# EAGLE design connector_schematic (EAGLE 9.3.2)
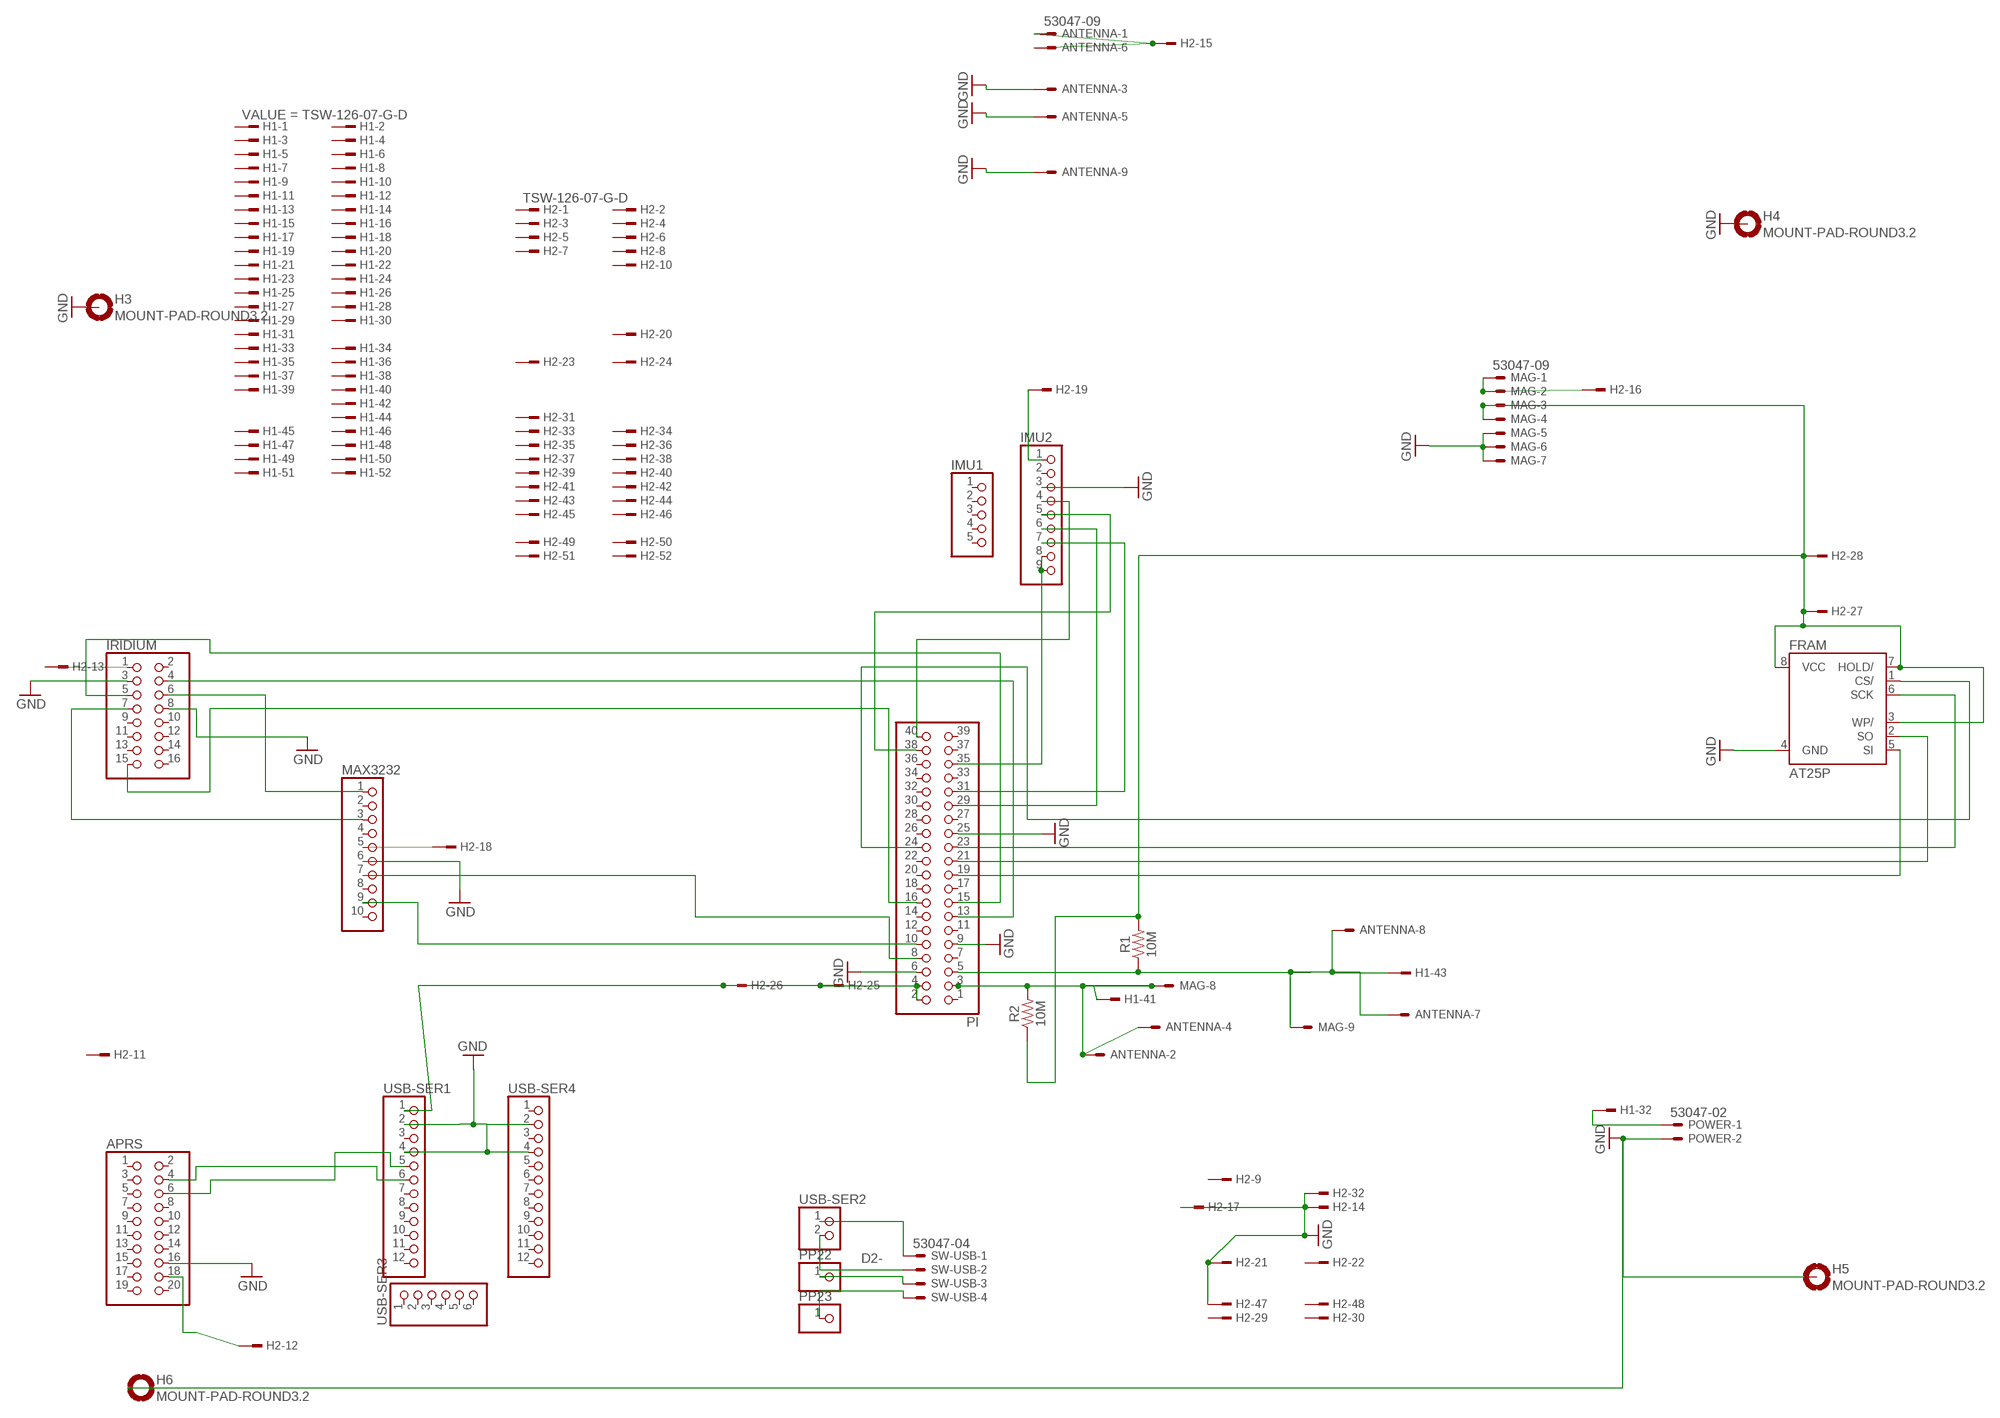
[diagram p0: schematic, sheet 1]

## Parts
ANTENNA  53047-09  [53047-09]
APRS  PINHD-2X10  [2X10]
FRAM  AT25P  [DIL08]
H1  TSW-126-07-G-D  [TSW-126-XX-G-D]
H2  TSW-126-07-G-D  [TSW-126-XX-G-D]
H3  MOUNT-PAD-ROUND3.2  [3,2-PAD]
H4  MOUNT-PAD-ROUND3.2  [3,2-PAD]
H5  MOUNT-PAD-ROUND3.2  [3,2-PAD]
H6  MOUNT-PAD-ROUND3.2  [3,2-PAD]
IMU1  PINHD-1X5  [1X05]
IMU2  PINHD-1X9  [1X09]
IRIDIUM  PINHD-2X8  [2X08]
MAG  53047-09  [53047-09]
MAX3232  PINHD-1X10  [1X10]
PI  PINHD-2X20  [2X20]
POWER  53047-02  [53047-02]
PP22  PINHD-1X1  [1X01]
PP23  PINHD-1X1  [1X01]
R1  10M  10MOHM-HORIZ-1/4W-5%  [AXIAL-0.3]
R2  10M  10MOHM-HORIZ-1/4W-5%  [AXIAL-0.3]
SW-USB  53047-04  [53047-04]
USB-SER1  PINHD-1X12  [1X12]
USB-SER2  PINHD-1X2  [1X02]
USB-SER3  PINHD-1X6  [1X06]
USB-SER4  PINHD-1X12  [1X12]

## Nets
3V3: FRAM.3(WP/) FRAM.7(HOLD/) FRAM.8(VCC) H2.27 H2.28 MAG.3 MAG.4 R1.P$2 R2.P$1
5V: H2.25 H2.26 PI.2 PI.4 USB-SER1.1
D2+: SW-USB.1 USB-SER2.1
D2-: SW-USB.2 USB-SER2.2
D+: PP22.1 SW-USB.3
D-: PP23.1 SW-USB.4
GND: ANTENNA.3 ANTENNA.5 ANTENNA.9 APRS.16 FRAM.4(GND) H2.14 H2.17 H2.21 H2.32 H2.47 H3.B3,2(MOUNT) H4.B3,2(MOUNT) H5.B3,2(MOUNT) H6.B3,2(MOUNT) IMU2.3 IRIDIUM.3 IRIDIUM.8 MAG.5 MAG.6 MAG.7 MAX3232.6 PI.6 PI.9 PI.25 POWER.2 USB-SER1.2 USB-SER1.4 USB-SER4.2 USB-SER4.4
N$1: APRS.18 H2.12
N$3: IMU2.5 PI.38
N$4: APRS.6 USB-SER1.5
N$5: H2.19 IMU2.1
N$6: ANTENNA.1 ANTENNA.6 H2.15
N$7: H2.13 IRIDIUM.1
N$8: IRIDIUM.4 PI.13
N$9: IRIDIUM.5 PI.15
N$10: IRIDIUM.15 PI.16
N$12: MAX3232.7 PI.8
N$13: H1.32 POWER.1
N$14: APRS.4 USB-SER1.6
N$17: FRAM.5(SI) PI.19
N$18: FRAM.6(SCK) PI.23
N$19: FRAM.1(CS/) PI.24
N$20: FRAM.2(SO) PI.21
N$21: MAX3232.9 PI.10
N$24: IRIDIUM.6 MAX3232.1
N$25: IRIDIUM.7 MAX3232.3
N$32: IMU2.4 PI.40
N$33: IMU2.6 PI.29
N$34: IMU2.7 PI.31
N$35: IMU2.8 IMU2.9 PI.35
N$36: H2.16 MAG.1 MAG.2
N$37: H2.18 MAX3232.5
SCL: ANTENNA.7 ANTENNA.8 H1.43 MAG.9 PI.5 R1.P$1
SDA: ANTENNA.2 ANTENNA.4 H1.41 MAG.8 PI.3 R2.P$2
Unconnected: APRS.1 APRS.2 APRS.3 APRS.5 APRS.7 APRS.8 APRS.9 APRS.10 APRS.11 APRS.12 APRS.13 APRS.14 APRS.15 APRS.17 APRS.19 APRS.20 H1.1 H1.2 H1.3 H1.4 H1.5 H1.6 H1.7 H1.8 H1.9 H1.10 H1.11 H1.12 H1.13 H1.14 H1.15 H1.16 H1.17 H1.18 H1.19 H1.20 H1.21 H1.22 H1.23 H1.24 H1.25 H1.26 H1.27 H1.28 H1.29 H1.30 H1.31 H1.33 H1.34 H1.35 H1.36 H1.37 H1.38 H1.39 H1.40 H1.42 H1.44 H1.45 H1.46 H1.47 H1.48 H1.49 H1.50 H1.51 H1.52 H2.1 H2.2 H2.3 H2.4 H2.5 H2.6 H2.7 H2.8 H2.9 H2.10 H2.11 H2.20 H2.22 H2.23 H2.24 H2.29 H2.30 H2.31 H2.33 H2.34 H2.35 H2.36 H2.37 H2.38 H2.39 H2.40 H2.41 H2.42 H2.43 H2.44 H2.45 H2.46 H2.48 H2.49 H2.50 H2.51 H2.52 IMU1.1 IMU1.2 IMU1.3 IMU1.4 IMU1.5 IMU2.2 IRIDIUM.2 IRIDIUM.9 IRIDIUM.10 IRIDIUM.11 IRIDIUM.12 IRIDIUM.13 IRIDIUM.14 IRIDIUM.16 MAX3232.2 MAX3232.4 MAX3232.8 MAX3232.10 PI.1 PI.7 PI.11 PI.12 PI.14 PI.17 PI.18 PI.20 PI.22 PI.26 PI.27 PI.28 PI.30 PI.32 PI.33 PI.34 PI.36 PI.37 PI.39 USB-SER1.3 USB-SER1.7 USB-SER1.8 USB-SER1.9 USB-SER1.10 USB-SER1.11 USB-SER1.12 USB-SER3.1 USB-SER3.2 USB-SER3.3 USB-SER3.4 USB-SER3.5 USB-SER3.6 USB-SER4.1 USB-SER4.3 USB-SER4.5 USB-SER4.6 USB-SER4.7 USB-SER4.8 USB-SER4.9 USB-SER4.10 USB-SER4.11 USB-SER4.12

## Library data of the parts
ANTENNA MAG = con-molex:53?-09: CONNECTOR wire to board 1.25 mm (.049 inch) pitch header; MF: MOLEX; MPN: 53047-0910; OC_FARNELL: 9732888; OC_NEWARK: 98K9827
APRS = pinhead:PINHD-2X10: PIN HEADER
FRAM = atmel:AT25*: SPI bus serial EEPROM; MPN: CAT25040LI-G; OC_FARNELL: 1718045; OC_NEWARK: 06R0588
H1 H2 = con-samtec:TSW-126-*-G: THROUGH-HOLE .025" SQ POST HEADER Source: Samtec TSW.pdf; MF: Samtec Inc.; MPN: TSW-126-07-G-D
H3-H6 = holes:MOUNT-PAD-ROUND: MOUNTING PAD, round
IMU1 = pinhead:PINHD-1X5: PIN HEADER
IMU2 = pinhead:PINHD-1X9: PIN HEADER
IRIDIUM = pinhead:PINHD-2X8: PIN HEADER
MAX3232 = pinhead:PINHD-1X10: PIN HEADER
PI = pinhead:PINHD-2X20: PIN HEADER
POWER = con-molex:53?-02: CONNECTOR wire to board 1.25 mm (.049 inch) pitch header; MF: MOLEX; MPN: 53047-0210; OC_FARNELL: 9733051; OC_NEWARK: 57H4701
PP22 PP23 = pinhead:PINHD-1X1: PIN HEADER
R1 R2 = SparkFun-Resistors:10MOHM: RES-09327; PROD_ID: RES-09327
SW-USB = con-molex:53?-04: CONNECTOR wire to board 1.25 mm (.049 inch) pitch header; MF: WALDOM/MOLEX; MPN: 53047-0410; OC_FARNELL: 9733060; OC_NEWARK: 38C9900
USB-SER1 USB-SER4 = pinhead:PINHD-1X12: PIN HEADER
USB-SER2 = pinhead:PINHD-1X2: PIN HEADER
USB-SER3 = pinhead:PINHD-1X6: PIN HEADER

## Net classes
0 default: width 0.61 mm, clearance 0.127 mm

## Board
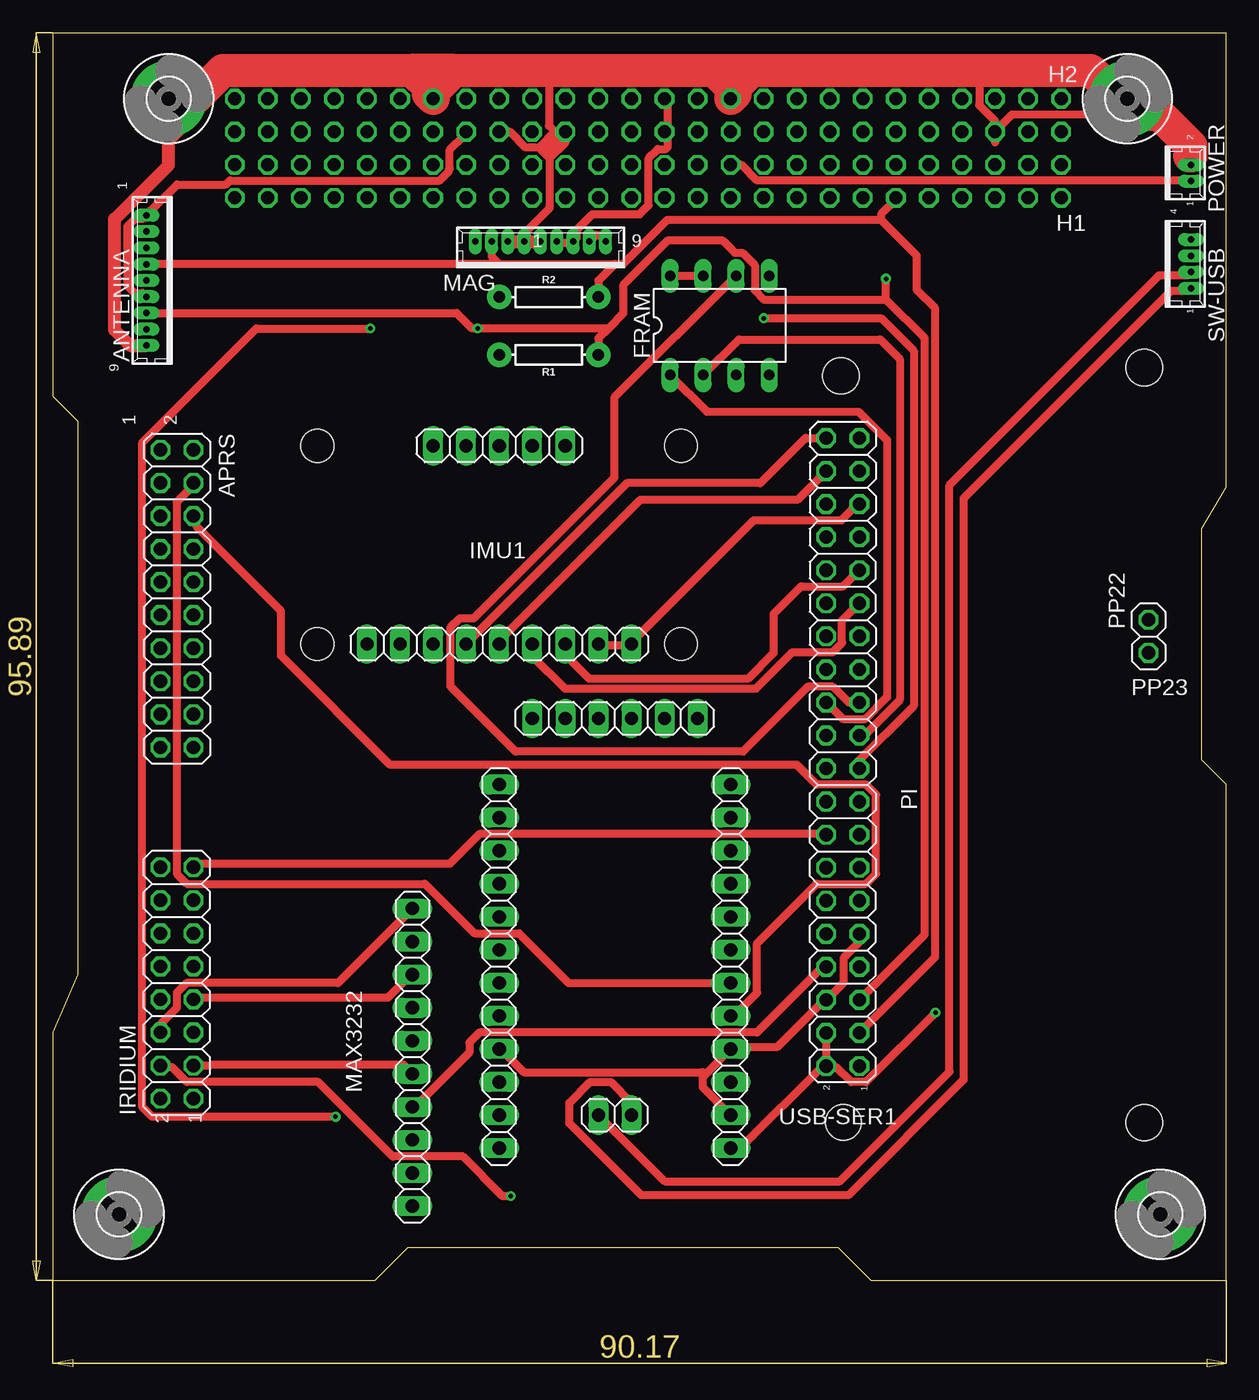
[diagram p1: board, top side]
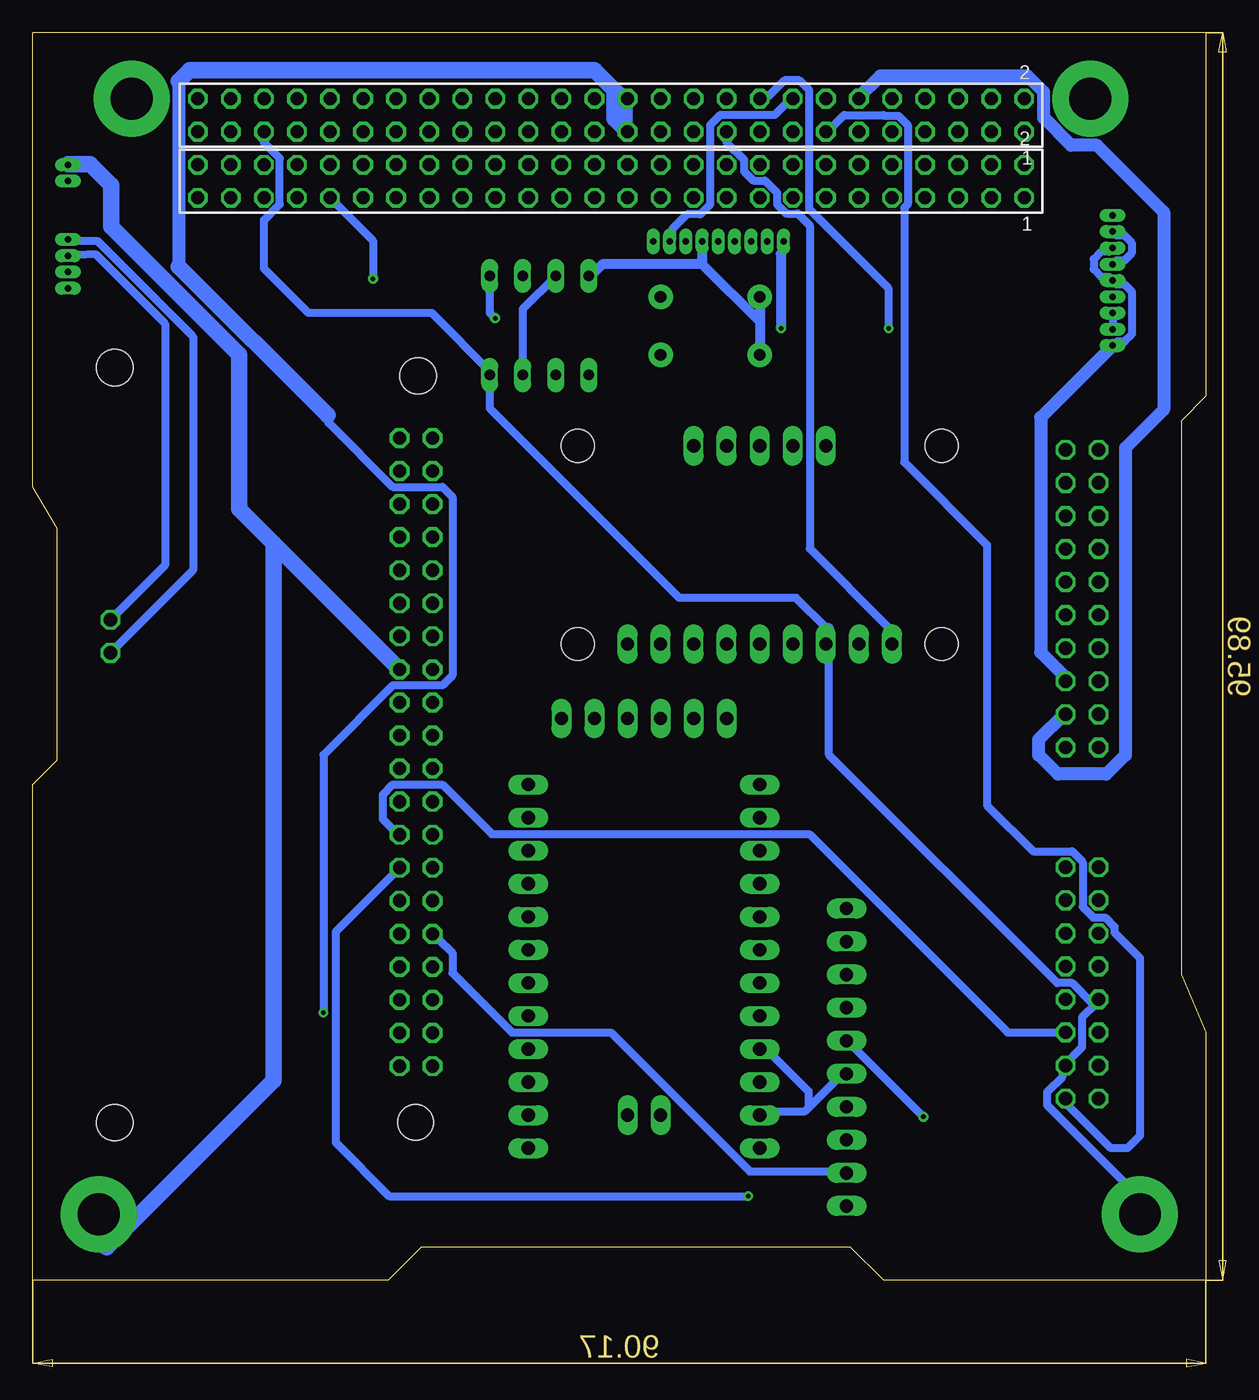
[diagram p2: board, bottom side, seen from below]

Size 90.17 x 95.89 mm. Coordinates in mm from the lower left corner, seen from the top.
Outline: 1.91,23.5 0,19.05 0,0 24.77,0 27.3,2.54 60.33,2.54 62.87,0 90.17,0 90.17,38.1 88.27,40.01 88.27,57.78 90.17,60.96 90.17,95.89 0,95.89 0,67.94 1.91,66.04 1.91,23.5
Copper layers (1*16): Top 0.035mm / dielectric 1.5mm / Bottom 0.035mm
Design rules "default": minimum track width 6mil, minimum drill 0.35mm, track to track 6mil, track to pad 6mil, pad to pad 6mil, via to via 6mil, smd to smd 6mil, copper to edge 40mil, drill to drill 6mil, minimum pad ring 10mil, minimum via ring 8mil, stop-mask expansion 4mil, vias tented up to drill 0mil, thermal gap 10mil
Holes 2.75 mm at 60.74,12.13
Holes 2.8 mm at 83.86,70.14 83.86,12.13 60.55,69.5
Holes 2.54 mm at 48.26,64.14 20.32,64.14 20.32,48.9 48.26,48.9

### Footprints (pad centres in the part's own frame; a part is rotated, then mirrored left to right if it is on the bottom)
53047-09 = drill 0.5 pad 0.698 long: 1 5,0.45; 2 3.75,0.45; 3 2.5,0.45; 4 1.25,0.45; 5 0,0.45; 6 -1.25,0.45; 7 -2.5,0.45; 8 -3.75,0.45; 9 -5,0.45
2X10 = drill 1.016 octagon: 1 -11.43,-1.27; 2 -11.43,1.27; 3 -8.89,-1.27; 4 -8.89,1.27; 5 -6.35,-1.27; 6 -6.35,1.27; 7 -3.81,-1.27; 8 -3.81,1.27; 9 -1.27,-1.27; 10 -1.27,1.27; 11 1.27,-1.27; 12 1.27,1.27; 13 3.81,-1.27; 14 3.81,1.27; 15 6.35,-1.27; 16 6.35,1.27; 17 8.89,-1.27; 18 8.89,1.27; 19 11.43,-1.27; 20 11.43,1.27
DIL08 = drill 0.813 long: 1 -3.81,-3.81; 2 -1.27,-3.81; 3 1.27,-3.81; 4 3.81,-3.81; 5 3.81,3.81; 6 1.27,3.81; 7 -1.27,3.81; 8 -3.81,3.81
TSW-126-XX-G-D = drill 1 pad 1.5 octagon: 1 31.75,-1.27; 2 31.75,1.27; 3 29.21,-1.27; 4 29.21,1.27; 5 26.67,-1.27; 6 26.67,1.27; 7 24.13,-1.27; 8 24.13,1.27; 9 21.59,-1.27; 10 21.59,1.27; 11 19.05,-1.27; 12 19.05,1.27; 13 16.51,-1.27; 14 16.51,1.27; 15 13.97,-1.27; 16 13.97,1.27; 17 11.43,-1.27; 18 11.43,1.27; 19 8.89,-1.27; 20 8.89,1.27; 21 6.35,-1.27; 22 6.35,1.27; 23 3.81,-1.27; 24 3.81,1.27; 25 1.27,-1.27; 26 1.27,1.27; 27 -1.27,-1.27; 28 -1.27,1.27; 29 -3.81,-1.27; 30 -3.81,1.27; 31 -6.35,-1.27; 32 -6.35,1.27; 33 -8.89,-1.27; 34 -8.89,1.27; 35 -11.43,-1.27; 36 -11.43,1.27; 37 -13.97,-1.27; 38 -13.97,1.27; 39 -16.51,-1.27; 40 -16.51,1.27; 41 -19.05,-1.27; 42 -19.05,1.27; 43 -21.59,-1.27; 44 -21.59,1.27; 45 -24.13,-1.27; 46 -24.13,1.27; 47 -26.67,-1.27; 48 -26.67,1.27; 49 -29.21,-1.27; 50 -29.21,1.27; 51 -31.75,-1.27; 52 -31.75,1.27
3,2-PAD = drill 3.2 pad 5.842: B3,2 0,0
1X05 = drill 1.016 long: 1 -5.08,0; 2 -2.54,0; 3 0,0; 4 2.54,0; 5 5.08,0
1X09 = drill 1.016 long: 1 -10.16,0; 2 -7.62,0; 3 -5.08,0; 4 -2.54,0; 5 0,0; 6 2.54,0; 7 5.08,0; 8 7.62,0; 9 10.16,0
2X08 = drill 1.016 octagon: 1 -8.89,-1.27; 2 -8.89,1.27; 3 -6.35,-1.27; 4 -6.35,1.27; 5 -3.81,-1.27; 6 -3.81,1.27; 7 -1.27,-1.27; 8 -1.27,1.27; 9 1.27,-1.27; 10 1.27,1.27; 11 3.81,-1.27; 12 3.81,1.27; 13 6.35,-1.27; 14 6.35,1.27; 15 8.89,-1.27; 16 8.89,1.27
1X10 = drill 1.016 long: 1 -11.43,0; 2 -8.89,0; 3 -6.35,0; 4 -3.81,0; 5 -1.27,0; 6 1.27,0; 7 3.81,0; 8 6.35,0; 9 8.89,0; 10 11.43,0
2X20 = drill 1.016 octagon: 1 -24.13,-1.27; 2 -24.13,1.27; 3 -21.59,-1.27; 4 -21.59,1.27; 5 -19.05,-1.27; 6 -19.05,1.27; 7 -16.51,-1.27; 8 -16.51,1.27; 9 -13.97,-1.27; 10 -13.97,1.27; 11 -11.43,-1.27; 12 -11.43,1.27; 13 -8.89,-1.27; 14 -8.89,1.27; 15 -6.35,-1.27; 16 -6.35,1.27; 17 -3.81,-1.27; 18 -3.81,1.27; 19 -1.27,-1.27; 20 -1.27,1.27; 21 1.27,-1.27; 22 1.27,1.27; 23 3.81,-1.27; 24 3.81,1.27; 25 6.35,-1.27; 26 6.35,1.27; 27 8.89,-1.27; 28 8.89,1.27; 29 11.43,-1.27; 30 11.43,1.27; 31 13.97,-1.27; 32 13.97,1.27; 33 16.51,-1.27; 34 16.51,1.27; 35 19.05,-1.27; 36 19.05,1.27; 37 21.59,-1.27; 38 21.59,1.27; 39 24.13,-1.27; 40 24.13,1.27
53047-02 = drill 0.5 pad 0.698 long: 1 0.625,0.45; 2 -0.625,0.45
1X01 = drill 1.016 octagon: 1 0,0
AXIAL-0.3 = drill 0.9 pad 1.88: P$1 -3.81,0; P$2 3.81,0
53047-04 = drill 0.5 pad 0.698 long: 1 1.875,0.45; 2 0.625,0.45; 3 -0.625,0.45; 4 -1.875,0.45
1X12 = drill 1.016 long: 1 -13.97,0; 2 -11.43,0; 3 -8.89,0; 4 -6.35,0; 5 -3.81,0; 6 -1.27,0; 7 1.27,0; 8 3.81,0; 9 6.35,0; 10 8.89,0; 11 11.43,0; 12 13.97,0
1X02 = drill 1.016 long: 1 -1.27,0; 2 1.27,0
1X06 = drill 1.016 long: 1 -6.35,0; 2 -3.81,0; 3 -1.27,0; 4 1.27,0; 5 3.81,0; 6 6.35,0

### Placement (x,y rotation side)
ANTENNA  7.62,76.83 90 top
APRS  9.53,52.39 270 top
FRAM  51.23,73.38 0 top
H1  45.72,84.45 0 bottom
H2  45.72,89.53 0 bottom
H3  5.08,5.08 0 top
H4  8.89,90.81 0 top
H5  82.55,90.81 0 top
H6  85.09,5.08 0 top
IMU1  34.29,64.14 0 top
IMU2  34.29,48.9 0 top
IRIDIUM  9.53,22.86 90 top
MAG  37.47,79.38 0 top
MAX3232  27.62,17.14 270 top
PI  60.69,40.6 90 top
POWER  87,85.09 270 top
PP22  84.19,50.76 90 top
PP23  84.19,48.22 0 top
R1  38.1,71.12 180 top
R2  38.1,75.56 0 top
SW-USB  87,78.11 270 top
USB-SER1  52.07,24.13 90 top
USB-SER2  43.18,12.7 180 top
USB-SER3  43.18,43.18 180 top
USB-SER4  34.29,24.13 90 top

### Tracks (layer width: path | path; a pad name or v marks a point on that pad's centre or on a via)
3V3
  Top 0.61: FRAM.7 FRAM.8 49.92,77.19 | 38.86,80.01 38.73,80.01 | 38.73,80.01 38.73,79.69 39.83,79.69 MAG.3 40.25,80.11 40.25,80.73 41.44,81.92 45.09,81.92 45.78,82.61 45.78,86.23 46.49,86.94 47.08,86.94 47.24,87.1 47.24,88.39 | 38.73,80.01 MAG.4 | 46.86,88.01 H2.27 47.24,88.39 | 47.24,88.39 47.24,90.68 H2.28
  Bottom 0.61: FRAM.7 52.5,74.64 FRAM.3 | FRAM.8 47.62,77.34 47.37,77.09
  Bottom 0.762: R2.P$1 34.29,73.66 | 34.29,73.66 R1.P$2 | MAG.4 38.72,78.08 | 38.72,78.08 34.29,73.66 | 38.72,78.08 46.38,78.08 47.37,77.09 47.62,76.83
5V  (via drill 0.35)
  Top 0.61: USB-SER1.1 52.2,10.29 52.96,10.29 59.05,16.38 PI.2 | PI.4 59.44,18.67 59.44,16.76 PI.2 | v67.82,20.57 62.48,15.24 61.34,15.24 60.2,16.38 59.44,16.38 PI.2
  Bottom 0.61: v67.82,20.57 67.82,40.39 62.48,45.72 58.67,45.72 57.91,46.48 57.91,60.2 58.67,60.96 62.48,60.96 67.44,65.91 67.51,66.47
  Bottom 0.813: H2.25 H2.26
  Bottom 1.016: 78.94,92.16 78.94,77.89
  Bottom 1.27: 45.45,91.44 46.99,92.98 78.11,92.98 78.94,92.16 | H2.25 45.45,89.26 45.45,91.44 | 78.94,77.89 67.51,66.47 | H2.26 44.81,90.81 45.45,91.44
D2+
  Top 0.61: SW-USB.1 87.25,76.03 85.91,76.03 69.96,60.08 69.96,15.39 61.11,6.54 45.21,6.54 39.69,12.06 39.69,13.65 41.27,15.24 42.86,15.24 44.45,13.65 USB-SER2.1
D2-
  Top 0.61: SW-USB.2 87.18,77.22 84.99,77.22 68.88,61.11 68.88,16.03 60.48,7.62 46.99,7.62 USB-SER2.2
D+
  Bottom 0.61: PP22.1 79.99,54.95 79.99,73.52 85.32,78.84 SW-USB.3
D-
  Bottom 0.61: SW-USB.4 87.35,79.88 85.22,79.88 77.83,72.5 77.83,54.57 PP23.1
GND
  Top 0.61: 38.16,86.23 39.37,87.44 H2.21 38.54,88.27 | 37.33,87.05 36.33,87.05 35.12,88.27 H2.17 | 38.54,88.27 37.33,87.05 | 70.48,92.98 71.18,92.29 71.18,90.3 72.39,89.09 H2.47 | H2.47 73.72,89.59 77.97,89.59 77.98,89.6 85.03,89.6 | H2.47 72.39,87.44 | 38.73,92.98 38.1,92.35 38.1,88.71 38.54,88.27 | PI.9 61.96,26 60.74,24.78 60.74,22.87 PI.6 59.05,21.34 55.63,17.91 52.2,17.91 USB-SER1.4 50.1,15.81 | MAX3232.6 26.92,16.57 12.13,16.57 12.06,16.51 IRIDIUM.3 | MAG.6 36.45,80.01 36.45,79.83 | H5.B3,2 82.68,91.06 82.17,90.55 | MAG.7 35.11,79.83 35.34,79.59 38.16,82.41 38.16,86.23 | 38.1,87 38.16,86.94 38.16,86.23 | 37.33,87.05 38.16,86.23 | USB-SER1.2 49.91,14.86 49.91,15.62 50.1,15.81 | POWER.2 87.63,85.72 87.44,86.39 | 50.1,15.81 49.91,16 36.2,16 34.29,17.91 USB-SER4.4
  Top 1.016: MAG.7 MAG.6 36.45,79.83 MAG.5 | H2.21 38.1,87 | H4.B3,2 8.89,88.27 10.48,89.85 11.11,89.85 8.89,87.63 8.89,85.71 4.74,81.56 4.74,73.03 5.93,71.83 ANTENNA.9
  Top 1.27: H2.32 50.53,92.35 49.53,92.35
  Top 2.54: 53.71,92.98 52.43,91.71 52.43,91.17 H2.32 | 53.71,92.98 70.48,92.98 79.74,92.98 82.17,90.55 | 27.57,92.98 28.85,91.71 | H4.B3,2 10.89,90.81 13.07,92.98 27.57,92.98 | 28.85,91.71 28.85,91.17 H2.14 | 28.85,91.71 29.57,91.71 30.85,92.98 | 30.85,92.98 38.73,92.98 53.71,92.98 | 30.85,92.98 27.57,92.98 | 87.35,86.39 87.44,86.39 87.44,87.18 85.03,89.6 83.76,89.6 H5.B3,2
  Bottom 0.61: 72.39,87.94 H2.47 72.39,87.44 71.18,86.23 71.18,82.68 72.39,81.47 72.39,77.75 68.97,74.33 59.48,74.33 54.88,69.72 FRAM.4 55.04,67.03 40.47,52.45 31.5,52.45 29.08,50.04 | H3.B3,2 5.08,6.35 12.19,13.46 12.19,14.48 11.05,15.62 11.05,16.38 | 27.62,16 MAX3232.6 27.81,16 30.54,13.27 | ANTENNA.3 7.46,79.05 8.07,79.05 8.63,78.48 8.63,77.69 8.07,77.12 7.46,77.12 ANTENNA.5 6.88,76.55 6.27,76.55 5.71,75.98 5.71,72.69 6.27,72.12 6.88,72.12 ANTENNA.9 | 11.05,16.38 9.53,17.91 9.53,20.19 8.38,21.34 IRIDIUM.8 8.76,21.34 10.29,22.86 11.43,22.86 28.96,40.39 28.96,48.77 IMU2.3 | USB-SER4.2 34.29,12.95 30.86,12.95 30.54,13.27 | USB-SER4.4 34.29,17.53 33.53,17.53 30.54,14.54 30.54,13.27 | POWER.2 87.63,85.72 87.44,85.76 | 11.05,16.38 IRIDIUM.3 | 83.5,3.49 H6.B3,2
  Bottom 1.016: ANTENNA.9 12.7,66.31 12.7,48.26 10.79,46.35 APRS.16 | IMU2.3 29.08,49.02 29.08,50.04
  Bottom 1.27: PI.25 71.64,56.63 | 71.64,56.63 74.3,59.28 74.3,71.12 84.14,80.96 84.14,84.14 85.76,85.76 87.44,85.76 | 71.64,56.63 71.64,15.36 83.5,3.49 84.45,2.54
N$1
  Bottom 1.016: H2.12 26.67,90.9 25.03,92.54 13.7,92.54 12.47,91.31 12.47,89.32 10.37,87.22 8.39,87.22 3.26,82.09 3.26,66.9 6.2,63.96 6.2,40.37 7.67,38.9 11.38,38.9 12.85,40.37 12.85,41.55 10.9,43.5 APRS.18
N$3
  Top 0.61: PI.38 57.2,59.97 45.11,59.97 34.29,49.15 IMU2.5
N$4
  Top 0.61: APRS.6 11.05,58.67 11.05,57.91 17.53,51.44 17.53,48.01 25.91,39.62 57.15,39.62 58.67,38.1 62.48,38.1 63.25,37.34 63.25,31.24 62.48,30.48 58.67,30.48 54.1,25.91 54.1,22.1 52.2,20.19 USB-SER1.5
N$5
  Bottom 0.61: IMU2.1 24.45,48.9 24.45,50.22 30.45,56.22 30.45,81.06 31.37,81.97 32.25,81.97 32.96,82.68 32.96,83.57 33.91,84.51 34.79,84.51 35.5,85.22 35.5,86.11 36.83,87.44 H2.19
N$6
  Top 0.61: H2.15 31.62,88.01 30.48,86.87 30.48,85.41 30.42,85.35 30.42,85.22 29.71,84.51 13.59,84.51 13.27,84.2 9.54,84.2 ANTENNA.1 6.88,81.55 6.27,81.55 5.71,80.98 5.71,76.44 6.27,75.87 6.88,75.87 ANTENNA.6
N$7
  Bottom 0.61: H2.13 28.96,88.39 27.81,89.53 24.77,89.53 24.71,89.48 23.63,89.48 22.92,88.77 22.92,82.68 23.18,82.42 23.18,62.87 16.83,56.52 16.83,36.51 13.28,32.97 10.29,32.97 9.47,32.15 9.47,28.7 8.66,27.89 7.75,27.89 7.04,27.18 7.04,26.72 5.08,24.77 5.08,11.11 6.03,10.16 7.3,10.16 10.79,13.65 IRIDIUM.1
N$8  (via drill 0.35)
  Top 0.61: v35.18,6.48 34.54,6.48 31.5,9.53 26.1,9.53 20.38,15.24 10.29,15.24 9.14,16.38 8.38,16.38 IRIDIUM.4
  Bottom 0.61: v35.18,6.48 62.76,6.48 66.88,10.59 66.88,26.79 PI.13
N$9
  Bottom 0.61: IRIDIUM.5 15.24,19.05 30.48,34.29 54.86,34.29 58.67,38.1 62.48,38.1 63.25,37.34 63.25,35.43 62.1,34.29 PI.15
N$10
  Top 0.61: IRIDIUM.15 11.05,32 30.48,32 32.77,34.29 59.05,34.29 PI.16
N$12
  Top 0.61: MAX3232.7 27.81,13.34 32,17.53 32,18.29 32.77,19.05 54.1,19.05 59.05,24 PI.8
N$13
  Top 0.61: H1.32 52.9,85.72 54.11,84.51 87.4,84.51 POWER.1
N$14
  Top 0.61: USB-SER1.6 39.62,22.86 35.81,26.67 32.38,26.67 28.57,30.48 10.29,30.48 9.53,31.24 9.53,59.82 10.67,60.96 APRS.4
N$17  (via drill 0.35)
  Top 0.61: v54.62,73.93 63.65,73.93 66.15,71.43 66.15,44.16 61.67,39.67 | 61.64,39.65 61.67,39.67 | PI.19 61.72,39.62 61.67,39.67
  Bottom 0.61: FRAM.5 55.04,74.35 v54.62,73.93
N$18
  Top 0.61: FRAM.6 52.48,77.19 43.13,67.83 43.13,61.67 32.34,50.88 31.25,50.88 30.53,50.16 30.53,45.67 35.56,40.64 53.02,40.64 58.01,45.63 59.92,45.63 61.14,44.41 PI.23
N$19
  Top 0.61: PI.24 60.69,43.14 62.41,43.14 64.08,44.81 64.08,64.57 61.91,66.75 50.24,66.75 FRAM.1
N$20
  Top 0.61: PI.21 62.09,41.62 65.07,44.6 65.07,70.8 63.57,72.3 52.7,72.3 FRAM.2
N$21
  Bottom 0.61: MAX3232.9 27.81,8.38 35.05,8.38 45.72,19.05 53.34,19.05 57.91,23.62 57.91,25.15 59.05,26.29 PI.10
N$24
  Top 0.61: MAX3232.1 21.91,22.86 10.29,22.86 9.53,22.1 9.53,20.95 8.38,19.81 8.38,19.05 IRIDIUM.6
N$25
  Top 0.61: IRIDIUM.7 11.05,21.72 25.72,21.72 27.62,23.62 MAX3232.3
N$32
  Top 0.61: IMU2.4 44.11,61.25 54.36,61.25 57.83,64.73 PI.40
N$33
  Top 0.61: IMU2.6 36.83,48 39.36,45.47 54.03,45.47 56.83,48.27 59.92,48.27 60.64,48.98 60.64,50.71 PI.29
N$34
  Top 0.61: IMU2.7 39.37,48.07 41.21,46.23 53.4,46.23 55.37,48.2 55.37,51.2 57.48,53.32 60.71,53.32 PI.31
N$35
  Top 0.61: IMU2.8 41.91,48.77 44.2,48.77 IMU2.9 44.58,49.15 53.85,58.42 60.6,58.42 61.71,59.52 PI.35
N$36
  Top 0.61: MAG.2 41.72,80.33 42.55,80.33 42.55,79.91 MAG.1
  Bottom 0.61: MAG.2 41.02,80.01 41.02,80.77 39.88,81.92 38.86,81.92 38.1,82.68 38.1,88.77 37.34,89.53 33.15,89.53 32,90.68 H2.16
N$37  (via drill 0.35)
  Top 0.61: v24.38,73.15 15.62,73.15 6.86,64.39 6.86,13.34 7.62,12.57 v21.72,12.57
  Bottom 0.61: v24.38,73.15 24.38,76.2 30.48,82.3 30.48,91.44 31.24,92.2 32.38,92.2 33.53,91.06 34.29,91.06 H2.18 | v21.72,12.57 27.43,18.29 MAX3232.5
SCL  (via drill 0.35)
  Top 0.61: 64.01,75.37 66.99,72.39 66.99,26.58 PI.5 | ANTENNA.7 31.03,74.33 32.21,73.15 v32.64,73.15 32.77,73.15 42.67,73.15 | 64.01,75.37 v64.01,76.96 | 42.67,73.15 43.81,74.3 43.81,76.46 47.27,79.92 51.44,79.92 52.39,78.96 52.96,78.96 53.92,78 53.92,76.06 54.61,75.37 64.01,75.37 | 42.67,73.15 41.91,72.39 R1.P$1
  Bottom 0.61: v64.01,76.96 64.01,79.88 H1.43 | ANTENNA.7 ANTENNA.8 | MAG.9 32.38,79.63 32.64,79.63 32.64,78.87 32.68,78.87 32.77,78.87
  Bottom 0.762: 32.68,78.89 32.68,78.87 32.68,73.19 v32.64,73.15
SDA
  Top 0.61: 63.63,81.5 63.63,81.92 64.77,83.06 H1.41 | 63.63,81.5 66.36,78.77 66.36,76.14 67.8,74.69 67.8,24.85 PI.3 | MAG.8 33.72,78.68 34.29,78.11 | 34.29,78.11 7.24,78.11 ANTENNA.4 | 34.29,78.11 43.18,78.11 | 43.18,78.11 43.81,78.11 47.21,81.5 63.63,81.5 | 43.18,78.11 41.91,76.83 R2.P$2
  Bottom 0.61: ANTENNA.4 6.88,78.37 6.27,78.37 5.71,78.94 5.71,79.73 6.27,80.3 6.88,80.3 ANTENNA.2

### Text on the board
tNames: 2 | 1 | 1 | 4 | 1 | 9 | 1 | 9 | 1 | 2 | 2 | 1 | 2 | 1